# EAGLE design P15_Dual (EAGLE 9.6.2)
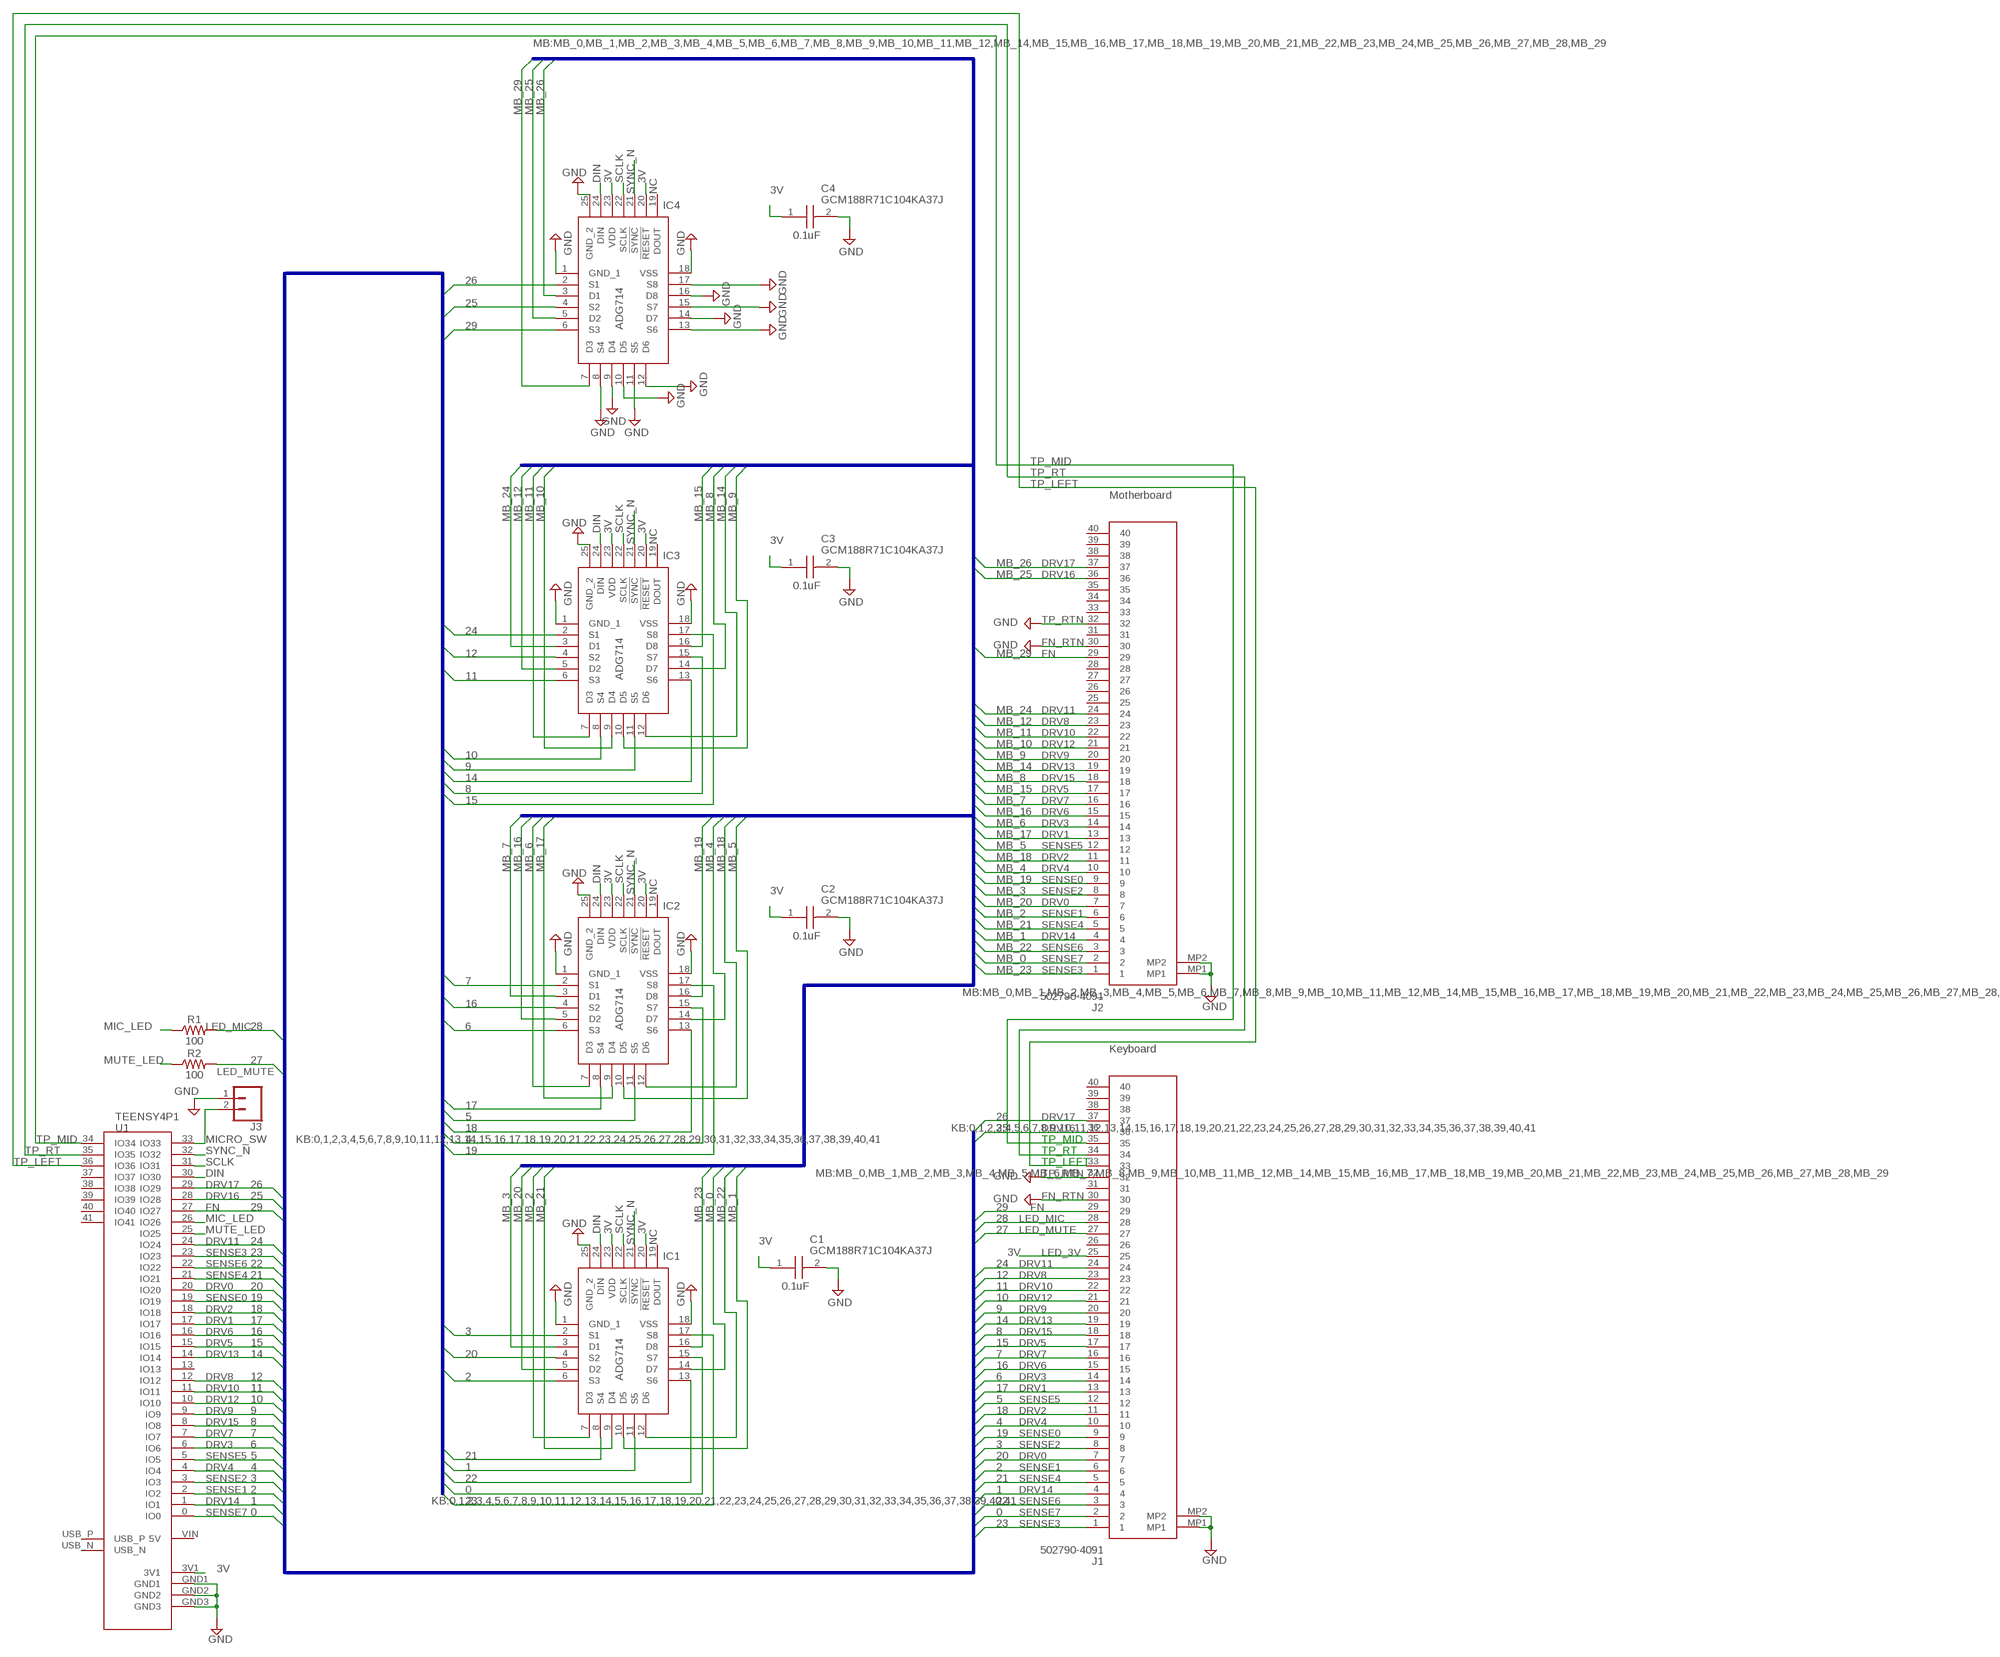
[diagram p0: schematic, sheet 1]

## Parts
C1  GCM188R71C104KA37J  [CAPC1608X90N]
C2  GCM188R71C104KA37J  [CAPC1608X90N]
C3  GCM188R71C104KA37J  [CAPC1608X90N]
C4  GCM188R71C104KA37J  [CAPC1608X90N]
IC1  ADG714BCPZ-REEL7  [QFN50P400X400X80-25N]
IC2  ADG714BCPZ-REEL7  [QFN50P400X400X80-25N]
IC3  ADG714BCPZ-REEL7  [QFN50P400X400X80-25N]
IC4  ADG714BCPZ-REEL7  [QFN50P400X400X80-25N]
J1  502790-4091  [5027904091]
J2  502790-4091  [5027904091]
J3  CONN_02  [1X02]
R1  100  0603_RESISTOR  [0603_RESISTOR]
R2  100  0603_RESISTOR  [0603_RESISTOR]
U1  TEENSY4P1  TEENSY4P1_CUTOUT_USB  [TEENSY4P1_CUTOUT_USB]

## Nets
0: IC1.15(S7) J1.2 U1.0(IO0)
1: IC1.11(S5) J1.4 U1.1(IO1)
2: IC1.6(S3) J1.6 U1.2(IO2)
3: IC1.2(S1) J1.8 U1.3(IO3)
3V: C1.1 C2.1 C3.1 C4.1 IC1.20(!RESET) IC1.23(VDD) IC2.20(!RESET) IC2.23(VDD) IC3.20(!RESET) IC3.23(VDD) IC4.20(!RESET) IC4.23(VDD) J1.25 U1.3V1
4: IC2.15(S7) J1.10 U1.4(IO4)
5: IC2.11(S5) J1.12 U1.5(IO5)
6: IC2.6(S3) J1.14 U1.6(IO6)
7: IC2.2(S1) J1.16 U1.7(IO7)
8: IC3.15(S7) J1.18 U1.8(IO8)
9: IC3.11(S5) J1.20 U1.9(IO9)
10: IC3.8(S4) J1.21 U1.10(IO10)
11: IC3.6(S3) J1.22 U1.11(IO11)
12: IC3.4(S2) J1.23 U1.12(IO12)
14: IC3.13(S6) J1.19 U1.14(IO14)
15: IC3.17(S8) J1.17 U1.15(IO15)
16: IC2.4(S2) J1.15 U1.16(IO16)
17: IC2.8(S4) J1.13 U1.17(IO17)
18: IC2.13(S6) J1.11 U1.18(IO18)
19: IC2.17(S8) J1.9 U1.19(IO19)
20: IC1.4(S2) J1.7 U1.20(IO20)
21: IC1.8(S4) J1.5 U1.21(IO21)
22: IC1.13(S6) J1.3 U1.22(IO22)
23: IC1.17(S8) J1.1 U1.23(IO23)
24: IC3.2(S1) J1.24 U1.24(IO24)
25: IC4.4(S2) J1.36 U1.28(IO28)
26: IC4.2(S1) J1.37 U1.29(IO29)
27: J1.27 R2.2
28: J1.28 R1.2
29: IC4.6(S3) J1.29 U1.27(IO27)
DIN: IC1.24(DIN) IC2.24(DIN) IC3.24(DIN) IC4.24(DIN) U1.30(IO30)
GND: C1.2 C2.2 C3.2 C4.2 IC1.1(GND_1) IC1.18(VSS) IC1.25(GND_2) IC2.1(GND_1) IC2.18(VSS) IC2.25(GND_2) IC3.1(GND_1) IC3.18(VSS) IC3.25(GND_2) IC4.1(GND_1) IC4.8(S4) IC4.9(D4) IC4.10(D5) IC4.11(S5) IC4.12(D6) IC4.13(S6) IC4.14(D7) IC4.15(S7) IC4.16(D8) IC4.17(S8) IC4.18(VSS) IC4.25(GND_2) J1.30 J1.32 J1.MP1 J1.MP2 J2.30 J2.32 J2.MP1 J2.MP2 J3.1 U1.GND1 U1.GND2 U1.GND3
MB_0: IC1.14(D7) J2.2
MB_1: IC1.10(D5) J2.4
MB_2: IC1.7(D3) J2.6
MB_3: IC1.3(D1) J2.8
MB_4: IC2.14(D7) J2.10
MB_5: IC2.10(D5) J2.12
MB_6: IC2.7(D3) J2.14
MB_7: IC2.3(D1) J2.16
MB_8: IC3.14(D7) J2.18
MB_9: IC3.10(D5) J2.20
MB_10: IC3.9(D4) J2.21
MB_11: IC3.7(D3) J2.22
MB_12: IC3.5(D2) J2.23
MB_14: IC3.12(D6) J2.19
MB_15: IC3.16(D8) J2.17
MB_16: IC2.5(D2) J2.15
MB_17: IC2.9(D4) J2.13
MB_18: IC2.12(D6) J2.11
MB_19: IC2.16(D8) J2.9
MB_20: IC1.5(D2) J2.7
MB_21: IC1.9(D4) J2.5
MB_22: IC1.12(D6) J2.3
MB_23: IC1.16(D8) J2.1
MB_24: IC3.3(D1) J2.24
MB_25: IC4.5(D2) J2.36
MB_26: IC4.3(D1) J2.37
MB_29: IC4.7(D3) J2.29
MIC_LED: R1.1 U1.26(IO26)
MICRO_SW: J3.2 U1.33(IO33)
MUTE_LED: R2.1 U1.25(IO25)
SCLK: IC1.22(SCLK) IC2.22(SCLK) IC3.22(SCLK) IC4.22(SCLK) U1.31(IO31)
SYNC_N: IC1.21(!SYNC) IC2.21(!SYNC) IC3.21(!SYNC) IC4.21(!SYNC) U1.32(IO32)
TP_LEFT: J1.33 U1.36(IO36)
TP_MID: J1.35 U1.34(IO34)
TP_RT: J1.34 U1.35(IO35)
Unconnected: IC1.19(DOUT) IC2.19(DOUT) IC3.19(DOUT) IC4.19(DOUT) J1.26 J1.31 J1.38 J1.39 J1.40 J2.25 J2.26 J2.27 J2.28 J2.31 J2.33 J2.34 J2.35 J2.38 J2.39 J2.40 U1.13(IO13) U1.37(IO37) U1.38(IO38) U1.39(IO39) U1.40(IO40) U1.41(IO41) U1.USB_N U1.USB_P U1.VIN(5V)

## Buses
KB:0,1,2,3,4,5,6,7,8,9,10,11,12,13,14,15,16,17,18,19,20,21,22,23,24,25,26,27,28,29,30,31,32,33,34,35,36,37,38,39,40,41
MB:MB_0,MB_1,MB_2,MB_3,MB_4,MB_5,MB_6,MB_7,MB_8,MB_9,MB_10,MB_11,MB_12,MB_14,MB_15,MB_16,MB_17,MB_18,MB_19,MB_20,MB_21,MB_22,MB_23,MB_24,MB_25,MB_26,MB_27,MB_28,MB_29

## Notes on the sheet
- NC
- 0.1uF
- ADG714
- Motherboard
- NC
- DRV17
- DRV16
- 0.1uF
- TP_RTN
- FN_RTN
- FN
- ADG714
- DRV11
- DRV8
- DRV10
- DRV12
- DRV9
- DRV13
- DRV15
- DRV5
- DRV7
- DRV6
- DRV3
- DRV1
- SENSE5
- DRV2
- DRV4
- SENSE0
- NC | SENSE2
- DRV0
- SENSE1
- SENSE4
- 0.1uF | DRV14
- SENSE6
- SENSE7
- SENSE3
- LED_MIC | ADG714
- Keyboard
- LED_MUTE
- DRV17
- DRV16
- TP_MID
- TP_RT
- TP_LEFT
- TP_RTN
- DRV17
- DRV16 | FN_RTN
- FN | FN
- LED_MIC
- LED_MUTE
- DRV11 | NC
- SENSE3 | LED_3V
- SENSE6 | DRV11
- SENSE4 | DRV8
- DRV0 | 0.1uF | DRV10
- SENSE0 | DRV12
- DRV2 | DRV9
- DRV1 | DRV13
- DRV6 | DRV15
- DRV5 | DRV5
- DRV13 | DRV7
- DRV6
- DRV8 | ADG714 | DRV3
- DRV10 | DRV1
- DRV12 | SENSE5
- DRV9 | DRV2
- DRV15 | DRV4
- DRV7 | SENSE0
- DRV3 | SENSE2
- SENSE5 | DRV0
- DRV4 | SENSE1
- SENSE2 | SENSE4
- SENSE1 | DRV14
- DRV14 | SENSE6
- SENSE7 | SENSE7
- SENSE3

## Library data of the parts
C1-C4 = SamacSys_Parts:GCM188R71C104KA37J: Multilayer Ceramic Capacitors MLCC - SMD/SMT .1uF 16Volts 10% Source: Datasheet <https://search.murata.co.jp/Ceramy/image/img/A01X/G101/ENG/GCM188R71C104KA37-01A.pdf>; DESCRIPTION: Multilayer Ceramic Capacitors MLCC - SMD/SMT .1uF 16Volts 10%; HEIGHT: 0.9mm; MANUFACTURER_NAME: Murata Electronics; MANUFACTURER_PART_NUMBER: GCM188R71C104KA37J; MOUSER_PART_NUMBER: 81-GCM188R71C104KA7J; MOUSER_PRICE-STOCK: https://www.mouser.co.uk/ProductDetail/Murata-Electronics/GCM188R71C104KA37J?qs=bGEzvQhTDnZD08oWyjLpYQ%3D%3D
IC1-IC4 = SamacSys_Parts:ADG714BCPZ-REEL7: Analog Switch ICs Low Voltage 3-wire Serially Controlled O Source: Datasheet <https://www.arrow.com/en/products/adg714bcpz-reel7/analog-devices>; DESCRIPTION: Analog Switch ICs Low Voltage 3-wire Serially Controlled O; HEIGHT: 0.8mm; MANUFACTURER_NAME: Analog Devices; MANUFACTURER_PART_NUMBER: ADG714BCPZ-REEL7; MOUSER_PART_NUMBER: 584-ADG714BCPZ-REEL7; MOUSER_PRICE-STOCK: https://www.mouser.co.uk/ProductDetail/Analog-Devices/ADG714BCPZ-REEL7?qs=%252BEew9%252B0nqrB1ZnOhtN6Fvw%3D%3D
J1 J2 = SamacSys_Parts:502790-4091: MOLEX - 502790-4091 - CONNECTOR, FPC, 40POS, 1ROW, 0.5MM Source: Datasheet <https://componentsearchengine.com/Datasheets/1/502790-4091.pdf>; DESCRIPTION: MOLEX - 502790-4091 - CONNECTOR, FPC, 40POS, 1ROW, 0.5MM; HEIGHT: 2.7mm; MANUFACTURER_NAME: Molex; MANUFACTURER_PART_NUMBER: 502790-4091; MOUSER_PART_NUMBER: 538-502790-4091; MOUSER_PRICE-STOCK: https://www.mouser.co.uk/ProductDetail/Molex/502790-4091?qs=3OKVfsn1b5DQ%252BzBia5ygSg%3D%3D
J3 = SparkFun-Connectors:CONN_02: Multi connection point. Often used as Generic Header-pin footprint for 0.1 inch spaced/style header connections On any of the 0.1 inch spaced packages, you can populate with these: Break Away Headers - Straight <https://www.sparkfun.com/products/116> (PRT-00116) Break Away Male Headers - Right Angle <https://www.sparkfun.com/products/553> (PRT-00553) Female Headers <https://www.sparkfun.com/products/115> (PRT-00115) Break Away Headers - Machine Pin <https://www.sparkfun.com/products/117> (PRT-00117) Break Away Female Headers - Swiss Machine Pin <https://www.sparkfun.com/products/743> (PRT-00743) For SCREWTERMINALS and SPRING TERMINALS visit here: Screw Terimnals on SparkFun.com <https://www.sparkfun.com/search/results?term=Screw+Terminals> (5mm/3.5mm/2.54mm spacing) This device is also useful as a general connection point to wire up your design to another part of your project. Our various solder wires solder well into these plated through hole pads. Hook-Up Wire - Assortment (Stranded, 22 AWG) <https://www.sparkfun.com/products/11375> (PRT-11375) Hook-Up Wire - Assortment (Solid Core, 22 AWG) <https://www.sparkfun.com/products/11367> (PRT-11367) View the entire wire category on our website here <https://www.sparkfun.com/categories/141> Special notes: Molex polarized connector foot print use with: PRT-08233 with associated crimp pins and housings. 2.54_SCREWTERM for use with PRT-10571. 3.5mm Screw Terminal footprints for PRT-08084 5mm Screw Terminal footprints for use with PRT-08432
R1 R2 = 0603_RESISTOR:0603_RESISTOR
U1 = TEENSY4P1_CUTOUT_USB:TEENSY4P1_CUTOUT_USB

## Board
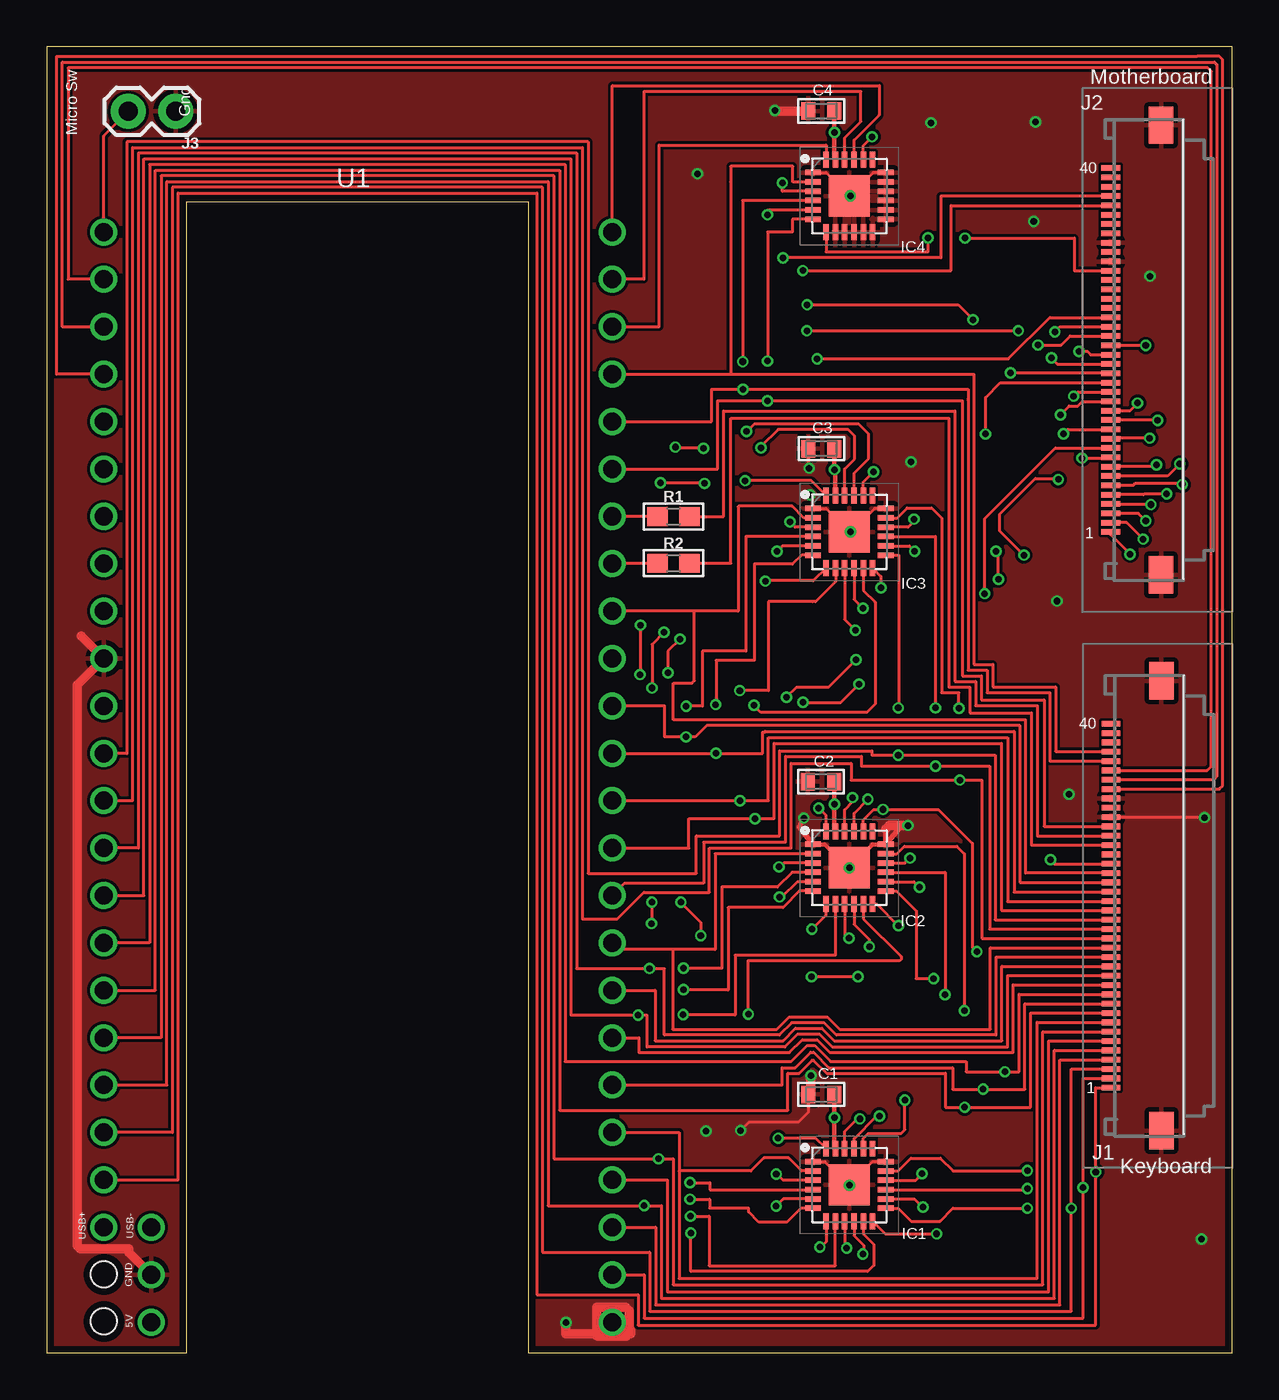
[diagram p1: board, top side]
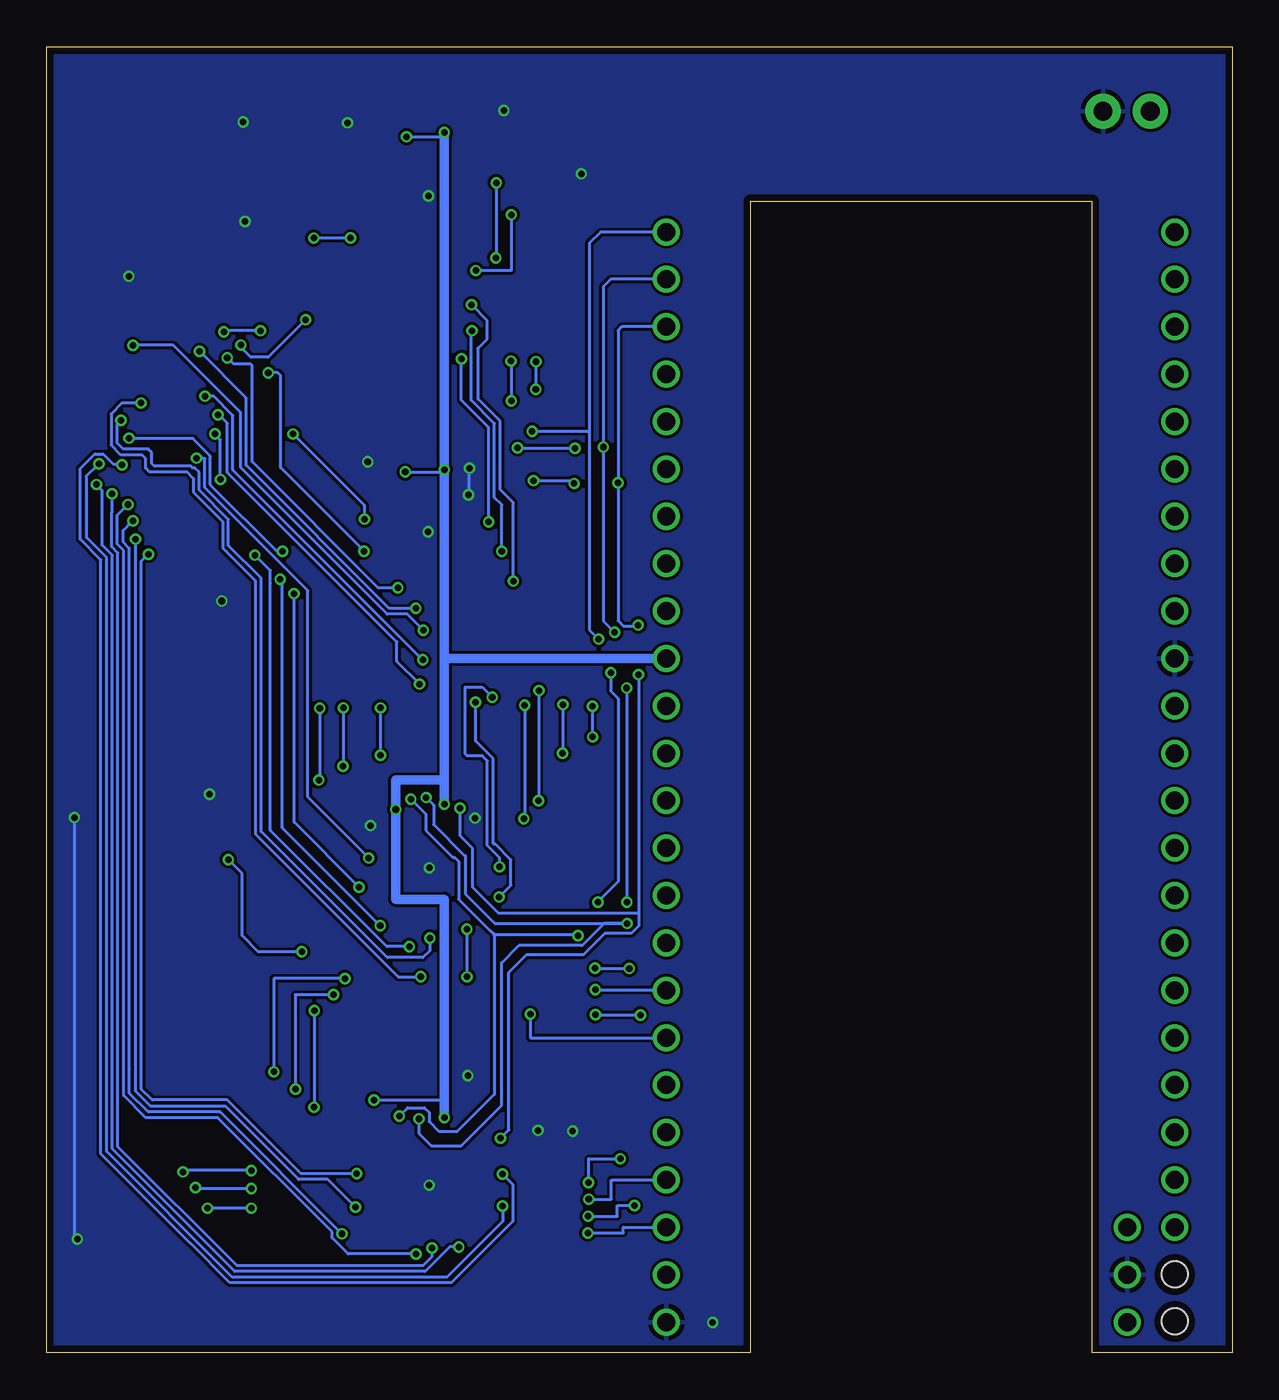
[diagram p2: board, bottom side, seen from below]

Size 63.5 x 70 mm. Coordinates in mm from the lower left corner, seen from the top.
Outline: 0,0 7.5,0 7.5,61.7 25.8,61.7 25.8,0 63.5,0 63.5,70 0,70 0,0
Copper layers (1*16): Top 0.035559375mm / dielectric 1.6mm / Bottom 0.035559375mm
Design rules "oshpark-2layer": minimum track width 6mil, minimum drill 10mil, track to track 6mil, track to pad 6mil, pad to pad 6mil, via to via 6mil, smd to smd 6mil, copper to edge 15mil, drill to drill 6mil, minimum pad ring 5mil, minimum via ring 5mil, stop-mask expansion 2.5mil, vias tented up to drill 0mil, thermal gap 10mil
Holes 1.4 mm at 3.07,1.68 3.07,4.2

### Footprints (pad centres in the part's own frame; a part is rotated, then mirrored left to right if it is on the bottom)
CAPC1608X90N = smd 0.75 x 0.94: 1 -0.7,0; 2 0.7,0
QFN50P400X400X80-25N = smd 0.85 x 0.3: 1 -1.95,1.25; 2 -1.95,0.75; 3 -1.95,0.25; 4 -1.95,-0.25; 5 -1.95,-0.75; 6 -1.95,-1.25; 13 1.95,-1.25; 14 1.95,-0.75; 15 1.95,-0.25; 16 1.95,0.25; 17 1.95,0.75; 18 1.95,1.25 | smd 0.3 x 0.85: 7 -1.25,-1.95; 8 -0.75,-1.95; 9 -0.25,-1.95; 10 0.25,-1.95; 11 0.75,-1.95; 12 1.25,-1.95; 19 1.25,1.95; 20 0.75,1.95; 21 0.25,1.95; 22 -0.25,1.95; 23 -0.75,1.95; 24 -1.25,1.95 | smd 2.2 x 2.2: 25 0,0
5027904091 = smd 0.3 x 1: 1 -9.75,2.6; 2 -9.25,2.6; 3 -8.75,2.6; 4 -8.25,2.6; 5 -7.75,2.6; 6 -7.25,2.6; 7 -6.75,2.6; 8 -6.25,2.6; 9 -5.75,2.6; 10 -5.25,2.6; 11 -4.75,2.6; 12 -4.25,2.6; 13 -3.75,2.6; 14 -3.25,2.6; 15 -2.75,2.6; 16 -2.25,2.6; 17 -1.75,2.6; 18 -1.25,2.6; 19 -0.75,2.6; 20 -0.25,2.6; 21 0.25,2.6; 22 0.75,2.6; 23 1.25,2.6; 24 1.75,2.6; 25 2.25,2.6; 26 2.75,2.6; 27 3.25,2.6; 28 3.75,2.6; 29 4.25,2.6; 30 4.75,2.6; 31 5.25,2.6; 32 5.75,2.6; 33 6.25,2.6; 34 6.75,2.6; 35 7.25,2.6; 36 7.75,2.6; 37 8.25,2.6; 38 8.75,2.6; 39 9.25,2.6; 40 9.75,2.6 | smd 2 x 1.3: MP1 -12.05,-0.1; MP2 12.05,-0.1
1X02 = drill 1.016 pad 1.88: 1 0,0; 2 2.54,0
0603_RESISTOR = smd 1.1 x 1: 1 -0.85,0; 2 0.85,0
TEENSY4P1_CUTOUT_USB = drill 0.965: 0 -15.24,-13.62; 1 -12.7,-13.62; 2 -10.16,-13.62; 3 -7.62,-13.62; 3V1 17.78,-13.62; 4 -5.08,-13.62; 5 -2.54,-13.62; 6 0,-13.62; 7 2.54,-13.62; 8 5.08,-13.62; 9 7.62,-13.62; 10 10.16,-13.62; 11 12.7,-13.62; 12 15.24,-13.62; 13 15.24,13.62; 14 12.7,13.62; 15 10.16,13.62; 16 7.62,13.62; 17 5.08,13.62; 18 2.54,13.62; 19 0,13.62; 20 -2.54,13.62; 21 -5.08,13.62; 22 -7.62,13.62; 23 -10.16,13.62; 24 20.32,-13.62; 25 22.86,-13.62; 26 25.4,-13.62; 27 27.94,-13.62; 28 30.48,-13.62; 29 33.02,-13.62; 30 35.56,-13.62; 31 38.1,-13.62; 32 40.64,-13.62; 33 40.64,13.62; 34 38.1,13.62; 35 35.56,13.62; 36 33.02,13.62; 37 30.48,13.62; 38 27.94,13.62; 39 25.4,13.62; 40 22.86,13.62; 41 20.32,13.62; GND1 -17.78,-13.62; GND2 -15.24,11.08; GND3 17.78,13.62; USB_N -12.7,11.08; USB_P -12.7,13.62; VIN -17.78,11.08

### Placement (x,y rotation side)
C1  41.49,13.85 180 top
C2  41.48,30.61 180 top
C3  41.5,48.45 180 top
C4  41.5,66.55 180 top
IC1  43,9 0 top
IC2  43,26 0 top
IC3  43,44 0 top
IC4  43,62 0 top
J1  59.62,23.96 90 top
J2  59.6,53.74 90 top
J3  6.91,66.53 180 top
R1  33.58,44.82 0 top
R2  33.58,42.32 0 top
U1  16.68,19.43 90 top

### Tracks (layer width: path | path; a pad name or v marks a point on that pad's centre or on a via)
0  (via drill 0.35)
  Top 0.152: J1.2 55.52,14.71 v55.52,8.85 55.52,1.86 32,1.86 32,4.19 U1.0 | IC1.15 52.55,8.75 v52.55,8.8 v52.53,8.8
  Bottom 0.152: v52.53,8.8 55.51,8.8 55.51,8.85 v55.52,8.85
1  (via drill 0.35)
  Top 0.152: U1.1 32.62,6.73 32.62,2.56 54.28,2.56 54.28,15.7 J1.4 | IC1.11 43.75,6.37 44.31,5.81 44.31,4.69 43.98,4.37 34.52,4.37 v34.52,6.42 v34.51,6.42
  Bottom 0.152: v34.51,6.42 32.61,6.42 32.61,6.73 U1.1
2  (via drill 0.35)
  Top 0.152: U1.2 33.25,9.27 33.25,3.26 53.68,3.26 53.68,16.71 J1.6 | IC1.6 40.41,7.75 39.66,7 38.15,7 37.6,7.55 37.6,7.75 35.51,7.75 35.51,8.23 v34.46,8.23
  Bottom 0.152: v34.46,8.23 33.25,8.23 33.25,9.27 U1.2
3
  Top 0.152: U1.3 33.88,11.81 33.88,9.75 | J1.8 53.07,17.71 53.07,3.98 33.88,3.98 33.88,9.75 | IC1.2 40.45,9.75 39.75,10.45 38.42,10.45 37.72,9.75 33.88,9.75
3V  (via drill 0.35)
  Top 0.152: IC4.20 43.75,64.7 v44.21,65.16 v44.22,65.16 v44.22,65.17 | IC3.20 43.75,46.67 v44.29,47.21 | IC2.20 43.75,28.57 44.3,29.12 v44.8,29.12 47.77,29.12 49.59,27.3 49.59,21.74 v49.83,21.5 | IC1.20 43.75,11.5 44.01,11.76 45.77,11.76 45.97,11.96 v45.97,13.55 | v53.77,26.43 53.99,26.21 J1.25
  Top 0.254: IC3.23 42.25,47.28 v42.2,47.33 C3.1 | IC4.23 42.2,64 v42.2,65.4 C4.1 | IC2.23 42.2,28 v42.2,29.4 v42.19,29.41 C2.1 | IC1.23 42.2,11 v42.2,12.6 C1.1
  Bottom 0.152: v44.22,65.17 42.26,65.17 42.2,65.11 | v44.29,47.21 42.21,47.21 42.2,47.2 | v42.2,29.4 42.2,30.69 | v49.83,21.5 52.17,21.5 53.03,22.36 53.03,25.69 v53.77,26.43 | 42.2,13.63 42.28,13.55 v45.97,13.55
  Bottom 0.508: v42.2,65.4 42.2,65.11 v42.2,47.33 42.2,47.2 42.2,37.21 | 42.2,37.21 v42.2,29.4 | v42.2,12.6 42.2,13.63 42.2,24.3 44.8,24.3 v44.8,29.12 44.8,30.69 42.2,30.69 | U1.3V1 42.2,37.21
4  (via drill 0.35)
  Top 0.152: U1.4 39.41,14.35 39.41,15.29 40.1,15.29 40.92,16.11 41.09,16.11 41.91,15.29 48.53,15.29 48.53,14.13 v50.17,14.13 52.41,14.13 52.41,18.71 J1.10 | v48.13,19.19 48.13,25.75 IC2.15
  Bottom 0.152: v48.13,19.19 50.19,19.19 50.19,14.13 v50.17,14.13
5  (via drill 0.35)
  Top 0.152: U1.5 31.73,16.89 31.73,16.09 39.79,16.09 40.48,16.78 41.27,16.78 41.96,16.09 51.78,16.09 51.78,19.72 J1.12 | IC2.11 43.75,23.26 45.77,21.24 45.77,21.08 45.7,21 37.56,21 37.56,18.15 v37.59,18.15
  Bottom 0.152: v37.59,18.15 37.59,16.89 U1.5
6  (via drill 0.35)
  Top 0.152: U1.6 32.59,19.43 32.59,16.73 39.45,16.73 40.11,17.39 41.52,17.39 42.18,16.73 51.17,16.73 51.17,20.71 J1.14 | IC2.6 40.33,24.75 39.45,23.87 36.51,23.87 36.51,19.45 v34.11,19.45 v34.11,19.46
  Bottom 0.152: v34.11,19.46 30.3,19.46 U1.6
7
  Top 0.152: U1.7 30.66,21.61 33.54,21.61 | J1.16 50.56,21.71 50.56,17.34 42.48,17.34 41.82,18 39.78,18 39.12,17.34 33.54,17.34 33.54,21.61 | IC2.2 35.81,26.75 35.81,21.61 33.54,21.61
8  (via drill 0.35)
  Top 0.152: U1.8 30.95,25.16 35.2,25.16 35.2,27.36 39.58,27.36 39.58,31.96 43.64,31.96 43.64,31.44 v47.62,31.44 50.51,31.44 50.51,22.71 J1.18 | IC3.15 47.61,43.75 v47.61,34.56
  Bottom 0.152: v47.61,34.56 v47.61,31.44 v47.62,31.44
9  (via drill 0.35)
  Top 0.152: J1.20 51.14,23.71 51.14,32.66 38.97,32.66 38.97,28.63 v37.94,28.63 34.41,28.63 34.41,27.05 U1.9 | IC3.11 43.75,40.86 44.38,40.23 44.38,34.77 43.94,34.33 38.26,34.33 v37.89,34.7
  Bottom 0.152: v37.94,28.63 37.89,28.63 v37.89,34.7
10  (via drill 0.35)
  Top 0.152: J1.21 57.02,24.19 51.48,24.19 51.48,32.97 38.66,32.97 38.66,29.59 v37.15,29.59 U1.10 | v37.13,35.49 38.66,35.49 38.66,40.26 41.04,40.26 41.19,40.26 42.27,41.34 42.27,42.03 IC3.8
  Bottom 0.152: v37.13,35.49 37.13,29.58 v37.15,29.58 v37.15,29.59
11  (via drill 0.35)
  Top 0.152: J1.22 51.83,24.7 51.83,33.31 38.49,33.31 38.49,33.27 38.36,33.27 38.36,32.13 v35.86,32.13 U1.11 | v35.84,34.74 35.87,34.74 35.87,37.11 37.91,37.11 37.91,42.28 37.93,42.26 39.95,42.26 40.44,42.75 IC3.6
  Bottom 0.152: v35.84,34.74 35.84,32.1 35.86,32.1 v35.86,32.13
12  (via drill 0.35)
  Top 0.152: U1.12 33.1,34.67 33.1,33.01 v34.25,33.01 34.74,33.01 35.35,33.62 52.14,33.62 52.14,25.21 J1.23 | v34.26,34.65 v34.26,34.66 35.13,34.66 35.13,37.61 37.46,37.61 37.46,43.75 IC3.4
  Bottom 0.152: v34.26,34.65 v34.26,33.01 v34.25,33 v34.25,33.01
14  (via drill 0.35)
  Top 0.152: U1.14 4.3,32.12 4.3,64.9 29,64.9 29,25.7 34.8,25.7 34.8,27.71 39.27,27.71 39.27,32.27 44.21,32.27 44.21,32.03 v45.62,32.03 50.81,32.03 50.81,23.21 J1.19 | IC3.13 45.65,42.75 45.65,34.56 v45.62,34.56
  Bottom 0.152: v45.62,34.56 v45.62,32.03
15  (via drill 0.35)
  Top 0.152: U1.15 4.6,29.59 4.6,64.6 28.7,64.6 28.7,23.25 30.56,23.25 31.99,24.68 35.51,24.68 35.51,27.05 39.88,27.05 39.88,31.59 43.09,31.59 43.09,30.7 v48.92,30.7 50.1,30.7 50.1,22.21 J1.17 | v48.87,34.54 48.87,35.37 47.94,35.37 47.94,44.75 47.41,45.28 46.1,45.28 45.57,44.75 IC3.17
  Bottom 0.152: v48.87,34.54 48.87,30.73 48.92,30.73 v48.92,30.7
16  (via drill 0.35)
  Top 0.152: U1.16 4.91,27.05 4.91,64.29 28.39,64.29 28.39,20.6 v32.29,20.6 33.09,20.6 33.09,17.04 39.25,17.04 39.91,17.7 41.65,17.7 42.31,17.04 50.87,17.04 50.87,21.21 J1.15 | v34.12,20.61 36.17,20.61 36.17,24.98 36.19,24.96 39.14,24.96 39.93,25.75 IC2.4
  Bottom 0.152: v34.12,20.61 32.31,20.61 32.31,20.6 v32.29,20.6
17  (via drill 0.35)
  Top 0.152: U1.17 5.21,24.51 5.21,63.99 28.09,63.99 28.09,18.1 v31.69,18.1 32.17,18.1 32.17,16.39 39.55,16.39 40.24,17.09 41.4,17.09 42.09,16.39 51.48,16.39 51.48,20.22 J1.13 | v34.1,18.12 v34.1,18.11 36.88,18.11 36.88,21.31 42.25,21.31 IC2.8
  Bottom 0.152: v34.1,18.12 31.69,18.12 v31.69,18.1
18  (via drill 0.35)
  Top 0.152: U1.18 5.52,21.98 5.52,63.68 27.78,63.68 27.78,15.62 39.88,15.62 40.74,16.48 41.15,16.48 42,15.62 49.25,15.62 49.25,15.06 v51.33,15.06 52.1,15.06 52.1,19.22 J1.11 | IC2.13 45.52,24.75 46.57,23.7 46.58,23.7 46.58,20.06 v47.52,20.06
  Bottom 0.152: v47.52,20.06 51.33,20.06 v51.33,15.06
19  (via drill 0.35)
  Top 0.152: U1.19 5.82,19.43 5.82,63.38 27.48,63.38 27.48,13 39.71,13 39.71,14.98 40.31,14.98 41.01,15.68 41.08,15.68 41.78,14.98 48.15,14.98 48.15,13.16 v49.18,13.16 52.71,13.16 52.71,18.21 J1.9 | v49.16,18.34 49.16,26.75 48.76,27.15 45.95,27.15 45.55,26.75 IC2.17
  Bottom 0.152: v49.16,18.34 49.16,13.18 49.18,13.18 v49.18,13.16
20  (via drill 0.35)
  Top 0.152: U1.20 6.13,16.89 6.13,63.07 27.17,63.07 27.17,10.4 v32.77,10.4 33.55,10.4 33.55,3.65 53.37,3.65 53.37,17.21 J1.7 | v34.47,9.12 35.53,9.12 35.53,8.74 IC1.4
  Bottom 0.152: v34.47,9.12 34.47,10.4 v32.77,10.4
21  (via drill 0.35)
  Top 0.152: U1.21 6.43,14.35 6.43,62.77 26.87,62.77 26.87,7.89 v32.01,7.89 32.93,7.89 32.93,2.92 53.98,2.92 53.98,16.21 J1.5 | IC1.8 42.25,4.67 35.49,4.67 35.49,7.32 v34.49,7.32
  Bottom 0.152: v34.49,7.32 32.93,7.32 32.93,7.9 v32.01,7.9 v32.01,7.89
22  (via drill 0.35)
  Top 0.152: U1.22 6.74,11.81 6.74,62.46 26.56,62.46 26.56,5.4 32.3,5.4 32.3,2.23 54.89,2.23 v54.89,7.75 54.89,15.21 J1.3 | IC1.13 45.62,7.75 46.31,7.06 47.86,7.06 48.55,7.75 v52.53,7.75
  Bottom 0.152: v52.53,7.75 v54.88,7.75 54.88,7.73 54.89,7.73 v54.89,7.75
23  (via drill 0.35)
  Top 0.152: U1.23 7.04,9.27 7.04,62.16 26.26,62.16 26.26,3.12 31.69,3.12 31.69,1.49 56.2,1.49 v56.2,9.7 56.2,14.21 J1.1 | IC1.17 45.62,9.75 46.3,10.43 47.88,10.43 48.56,9.75 52.55,9.75 v52.55,9.77 v52.53,9.77
  Bottom 0.152: v52.53,9.77 56.21,9.77 56.21,9.68 56.2,9.68 v56.2,9.7
24
  Top 0.152: J1.24 52.45,25.71 52.45,33.92 33.58,33.92 33.58,35.89 34.57,35.89 34.7,36.02 34.7,39.75 | 34.7,39.75 U1.24 | 34.7,39.75 37.04,39.75 37.04,45.34 37.07,45.37 39.94,45.37 40.56,44.75 IC3.2
25  (via drill 0.35)
  Top 0.152: U1.28 35.62,49.91 35.62,51.64 v37.3,51.64 49.37,51.64 49.37,51.12 49.37,51.04 49.37,36.59 50.38,36.59 50.38,35.38 53.74,35.38 53.74,31.71 J1.36 | IC4.4 37.29,61.75 v37.29,53.12
  Bottom 0.152: v37.29,53.12 v37.29,51.64 v37.3,51.64
26
  Top 0.152: U1.29 36.64,52.45 | 36.64,52.45 49.67,52.45 49.67,36.89 50.68,36.89 50.68,35.69 54.05,35.69 54.05,32.23 57.02,32.23 J1.37 | IC4.2 39.97,62.75 39.97,63.59 36.64,63.59 36.64,62.75 36.64,52.45
27
  Top 0.152: R2.2 36.65,42.32 36.65,50.09 48.33,50.09 48.33,35.67 49.46,35.67 49.46,34.3 52.75,34.3 52.75,27.21 J1.27
28
  Top 0.152: R1.2 36.27,44.82 36.27,50.47 48.66,50.47 48.66,35.98 49.77,35.98 49.77,34.69 53.08,34.69 53.08,27.7 J1.28
29  (via drill 0.35)
  Top 0.152: U1.27 35.94,47.37 35.94,51.02 v38.61,51.02 49.06,51.02 49.06,36.28 50.07,36.28 50.07,35 53.44,35 53.44,28.21 J1.29 | IC4.6 39.95,60.75 39.95,60.07 38.62,60.07 v38.62,53.15
  Bottom 0.152: v38.62,53.15 v38.62,51.02 v38.61,51.02
DIN  (via drill 0.35)
  Top 0.152: IC4.24 41.75,64.73 32.81,64.73 32.81,54.99 U1.30 | IC3.24 40.96,46.74 v37.42,46.74 | v35.24,46.59 35.22,46.61 v32.9,46.61 v32.89,46.62 | v31.81,39 31.81,36.35 v31.79,36.35 | IC1.24 41.21,11.49 v39.2,11.49 v39.19,11.5 | v41.36,29.19 41.75,28.8 IC2.24
  Bottom 0.152: U1.30 32.68,54.99 32.89,54.78 v32.89,46.62 32.89,39.24 32.61,38.96 31.82,38.96 31.81,38.97 v31.81,39 | v37.42,46.74 35.39,46.74 v35.24,46.59 | v31.79,36.35 31.79,23.58 | 31.79,23.58 39.31,23.58 40.69,24.96 40.69,27.05 41.36,27.72 v41.36,29.19 | v39.19,11.5 38.74,11.95 38.74,20.39 37.8,21.33 34.75,21.33 33.6,22.48 32.18,22.48 31.79,22.87 31.79,23.58
GND  (via drill 0.35)
  Top 0.152: C1.2 40.79,12.88 40.27,12.36 37.62,12.36 v37.18,11.92 | IC1.1 41.69,10.25 42.94,9 IC1.25 44.24,10.25 IC1.18 | 42.93,26 IC2.25 | 45.82,28.26 v46.15,28.26 | IC3.18 44.35,45.25 43.1,44 IC3.25 41.75,45.25 IC3.1 41.05,45.97 41.04,45.98 v40.9,45.98 | IC4.1 41.75,63.25 IC4.25 43.02,62 44.27,63.25 IC4.18 | C3.2 40.8,47.46 v40.85,47.41 | J1.30 61.94,28.71 61.99,28.66 v62.02,28.69
  Top 0.203: IC2.1 41.68,27.25 42.93,26 | IC2.25 44.25,27.25 IC2.18
  Top 0.305: 44.95,28.08 IC2.18 45.82,28.26 | IC2.1 40.32,28.19 v40.56,28.66
  Top 0.508: C4.2 39.04,66.55 v39.01,66.58 | C1.2 40.94,14 v40.94,14.86 | v40.94,14.86 | 44.95,28.08 45.13,28.26 v46.15,28.26 | U1.GND2 4.41,5.38 4.41,5.58 1.8,5.58 1.64,5.74 1.64,35.79 U1.GND3 1.86,38.41 | U1.GND1 31.04,0.91 31.04,0.88 29.51,0.88 29.47,0.92 29.47,2.44 31.02,2.44 31.21,2.25 31.21,1.29 31.29,1.21 31.29,1.02 27.82,1.02 v27.82,1.63
  Bottom 0.152: v40.85,47.41 40.9,47.36 v40.9,45.98 | v62.02,28.69 62.02,6.26 v61.86,6.1
  other vias: 35.32,11.89 43.01,8.98 43,25.99 43.06,44 43.05,62 34.86,63.19 47.38,65.92 52.97,65.96 46.3,47.75 54.12,40.29 54.77,29.94 52.88,60.64 59.1,57.7
  pour Top: 0,0 0,70 63.5,70 63.5,0 25.8,0 25.8,61.7 7.5,61.7 7.5,0
  pour Bottom: 0,0 0,70 63.48,70 63.48,0 25.8,0 25.8,61.7 7.5,61.7 7.5,0
MB_0  (via drill 0.35)
  Top 0.152: IC1.14 46.49,8.25 v46.94,7.8 v46.95,7.81 | v58.74,43.61 57.86,44.49 J2.2
  Bottom 0.152: v46.95,7.81 48.44,9.29 50,9.29 53.91,13.21 57.93,13.21 58.74,14.02 v58.74,43.61
MB_1  (via drill 0.35)
  Top 0.152: IC1.10 43.25,6.28 43.76,5.77 43.76,5.34 v43.72,5.3 | v59.15,45.46 57.03,45.46 J2.4
  Bottom 0.152: v43.72,5.3 47.35,5.3 48.21,6.16 48.21,6.48 54.33,12.6 58.18,12.6 59.38,13.79 59.38,42.99 59.72,43.33 59.72,44.9 v59.15,45.46
MB_2  (via drill 0.35)
  Top 0.152: IC1.7 41.75,5.94 41.45,5.64 v41.42,5.67 | v60.84,46.53 60.8,46.58 58.3,46.58 58.21,46.49 J2.6
  Bottom 0.152: v41.42,5.67 41.92,5.67 43.22,4.37 53.43,4.37 59.98,10.92 59.98,42.74 60.53,43.29 60.53,46.22 v60.84,46.53
MB_3  (via drill 0.35)
  Top 0.152: IC1.3 39.45,9.25 v39.1,9.6 v39.09,9.59 | v59.46,47.59 59.36,47.49 J2.8
  Bottom 0.152: v39.09,9.59 38.53,9.03 38.53,7.04 41.81,3.76 53.68,3.76 55.78,5.86 55.8,5.86 60.59,10.65 60.59,42.49 61.7,43.6 61.7,47.39 60.92,48.17 60.48,48.17 59.93,47.62 59.49,47.62 v59.46,47.59
MB_4  (via drill 0.35)
  Top 0.152: IC2.14 46.46,25.25 v46.76,24.95 v46.77,24.95 | v50.25,40.69 50.25,44.7 54.04,48.49 J2.10
  Bottom 0.152: v46.77,24.95 50.25,28.44 v50.25,40.69
MB_5  (via drill 0.35)
  Top 0.152: IC2.10 43.25,22.97 44.07,22.15 v44.07,21.77 | v52.35,42.75 51.05,44.05 51.05,44.95 52.96,46.86 54.2,46.86 v54.2,46.81 v54.2,46.8 | v54.48,49.25 54.72,49.49 J2.12
  Bottom 0.152: v44.07,21.77 45.28,21.77 51.51,28 51.51,41.23 51.52,41.24 51.52,41.93 v52.34,42.75 v52.35,42.75 | v54.2,46.8 54.2,48.92 54.49,49.22 v54.49,49.24 v54.48,49.25
MB_6  (via drill 0.35)
  Top 0.152: J2.14 58.04,50.49 v58.44,50.89 v58.44,50.9 | v43.46,20.16 v40.99,20.16 v40.98,20.15 | v40.99,22.7 41.75,23.46 IC2.7
  Bottom 0.152: v58.44,50.9 59.47,50.9 60.05,50.32 60.05,48.65 59.52,48.12 58.39,48.12 58.2,47.93 58.2,47.41 58,47.2 55.98,47.2 55.64,46.87 55.64,46.12 54.06,44.54 54.06,43.12 53.89,42.95 53.88,42.95 52.31,41.38 52.31,27.81 44.66,20.16 v43.46,20.16 | v40.98,20.15 40.98,22.68 v40.99,22.69 v40.99,22.7
MB_7  (via drill 0.35)
  Top 0.152: IC2.3 39.49,26.25 39.26,26.02 v39.23,26.05 | v43.35,37.14 41.89,35.68 40.17,35.68 v39.63,35.14 | v55.02,51.27 55.24,51.49 J2.16
  Bottom 0.152: v39.23,26.05 39.23,26.52 39.89,27.18 39.89,31.72 40.16,31.99 40.97,31.99 41.08,32.1 41.08,35.68 40.17,35.68 v39.63,35.14 | v43.35,37.14 53.52,47.31 53.52,50.23 54.56,51.27 v55.02,51.27
MB_8  (via drill 0.35)
  Top 0.152: IC3.14 46.21,43.25 v46.5,42.96 | v51.63,52.52 56.97,52.52 J2.18
  Bottom 0.152: v46.5,42.96 50.97,47.43 50.97,52.38 51.11,52.52 v51.63,52.52
MB_9  (via drill 0.35)
  Top 0.152: IC3.10 43.25,40.38 v43.73,39.9 | v55.31,53.67 55.75,53.67 55.93,53.49 J2.20
  Bottom 0.152: v43.73,39.9 45.13,39.9 52.81,47.57 52.81,51.17 v55.31,53.67
MB_10  (via drill 0.35)
  Top 0.152: IC3.9 42.75,39.3 v43.32,38.73 | v58.88,53.99 J2.21
  Bottom 0.152: v43.32,38.73 44.18,39.59 45.26,39.59 53.12,47.44 53.12,50.4 56.73,54.01 58.88,54.01 v58.88,53.99
MB_11  (via drill 0.35)
  Top 0.152: IC3.7 41.08,41.38 38.52,41.38 v38.5,41.36 | v40.74,56.17 48.83,56.17 v49.63,55.37 v49.62,55.37 | v53.1,54.01 54.34,54.01 54.83,54.5 J2.22
  Bottom 0.152: v38.5,41.36 38.5,45.56 39.21,46.27 39.21,49.93 40.38,51.1 40.38,53.85 39.9,54.33 39.9,55.33 v40.74,56.17 | v49.62,55.37 51.63,53.36 52.56,53.36 53.1,53.9 v53.1,54.01
MB_12  (via drill 0.35)
  Top 0.152: IC3.5 39.41,43.25 v39.12,42.96 | v40.72,54.78 v52.05,54.78 | v54.01,54.72 54.28,54.99 J2.23
  Bottom 0.152: v39.12,42.96 39.12,45.45 39.52,45.84 39.52,49.8 40.76,51.05 40.76,53.04 40.75,53.05 40.75,54.75 v40.72,54.78 | v52.05,54.78 53.95,54.78 v54.01,54.72
MB_14  (via drill 0.35)
  Top 0.152: IC3.12 44.69,41.61 v44.69,41 | v53.83,53.31 54.15,52.99 J2.19
  Bottom 0.152: v44.69,41 45.74,41 52.5,47.76 52.5,52.92 52.57,52.99 53.49,52.99 v53.82,53.32 v53.83,53.31
MB_15  (via drill 0.35)
  Top 0.152: v46.47,44.68 46.47,44.57 46.15,44.25 IC3.16 | v50.3,49.24 50.3,51.2 51.09,51.99 J2.17
  Bottom 0.152: v46.47,44.68 46.47,45.41 v50.3,49.24
MB_16  (via drill 0.35)
  Top 0.152: IC2.5 40.21,25.25 39.39,24.43 v39.26,24.43 | v40.52,34.86 42.54,34.86 v43.52,35.84 | J2.15 55.49,50.99 55.24,50.74 54.78,50.74 v54.31,50.27
  Bottom 0.152: v39.26,24.43 38.63,25.06 38.63,26.42 39.48,27.27 39.54,27.27 39.59,27.32 39.59,31.85 40.52,32.78 v40.52,34.86 | v43.52,35.84 44.74,37.06 44.74,38.1 53.83,47.18 53.83,49.81 54.3,50.29 v54.31,50.27
MB_17  (via drill 0.35)
  Top 0.152: IC2.9 42.76,22.41 42.96,22.21 v42.98,22.23 | v59.52,49.98 J2.13
  Bottom 0.152: v42.98,22.23 42.99,22.21 42.99,21.53 43.34,21.18 45.25,21.18 52.01,27.94 52.01,41.52 53.74,43.25 53.76,43.25 53.76,44.67 55.34,46.24 55.34,47.2 55.55,47.42 55.69,47.42 55.78,47.51 57.73,47.51 57.88,47.66 57.88,48.26 58.05,48.44 59.41,48.44 59.73,48.76 59.73,49.77 v59.52,49.98
MB_18  (via drill 0.35)
  Top 0.152: IC2.12 44.46,24.05 v45.62,22.89 v45.63,22.89 | v50.99,41.46 50.99,42.82 v50.86,42.95 | v59.09,49.02 57.03,49.02 J2.11
  Bottom 0.152: v45.63,22.89 50.87,28.13 50.87,41.34 v50.99,41.46 | v50.86,42.95 51.16,42.95 54.73,46.52 54.73,48.05 55.6,48.92 55.6,48.94 55.66,49 59.09,49 v59.09,49.02
MB_19  (via drill 0.35)
  Top 0.152: IC2.16 45.98,26.25 v46.25,26.52 | v55.47,47.95 56.96,47.95 J2.9
  Bottom 0.152: v46.25,26.52 49.51,29.78 49.51,40.85 55.03,46.37 55.03,47.92 55.47,47.92 v55.47,47.95
MB_20  (via drill 0.35)
  Top 0.152: IC1.5 39.46,8.25 v39.08,7.87 | v60.7,47.64 60.05,46.99 J2.7
  Bottom 0.152: v39.08,7.87 39.08,7.04 42.06,4.06 53.55,4.06 60.29,10.8 60.29,42.62 61.37,43.69 61.37,46.93 61.4,46.96 60.72,47.64 v60.7,47.64
MB_21  (via drill 0.35)
  Top 0.152: IC1.9 42.75,5.77 42.88,5.64 v42.86,5.62 | v60,46.03 58.8,46.03 58.76,45.99 J2.5
  Bottom 0.152: v42.86,5.62 42.86,5.16 43.35,4.67 53.3,4.67 59.68,11.05 59.68,42.87 60.02,43.21 60.02,45.02 60,45.04 v60,46.03
MB_22  (via drill 0.35)
  Top 0.152: IC1.12 44.92,6.38 v47.68,6.38 | v58.88,44.59 58.48,44.99 J2.3
  Bottom 0.152: v47.68,6.38 54.2,12.9 58.06,12.9 59.06,13.91 59.06,15.21 59.06,43.12 59.41,43.46 59.41,44.08 58.91,44.58 v58.89,44.58 v58.88,44.59
MB_23  (via drill 0.35)
  Top 0.152: IC1.16 46.56,9.25 v46.9,9.59 v46.89,9.6 | v58.04,42.8 57,43.84 J2.1
  Bottom 0.152: v46.89,9.6 49.87,9.6 53.82,13.55 57.84,13.55 58.42,14.13 58.42,42.44 58.06,42.8 v58.04,42.8
MB_24  (via drill 0.35)
  Top 0.152: IC3.3 40.1,44.25 v39.82,44.53 | v41.28,53.27 51.52,53.27 53.74,55.49 J2.24
  Bottom 0.152: v39.82,44.53 39.82,49.59 41.28,51.05 v41.28,53.27
MB_25  (via drill 0.35)
  Top 0.152: IC4.5 38.61,61.25 v38.61,60.99 | v40.51,58 48.45,58 48.45,61.49 J2.36
  Bottom 0.152: v38.61,60.99 38.61,58 v40.51,58
MB_26  (via drill 0.35)
  Top 0.152: v39.41,62.7 39.41,62.25 IC4.3 | v39.44,58.68 47.9,58.68 47.9,61.99 J2.37
  Bottom 0.152: v39.41,62.7 39.41,58.66 39.44,58.66 v39.44,58.68
MB_29  (via drill 0.35)
  Top 0.152: IC4.7 41.75,59.01 47.22,59.01 v47.22,59.75 | v49.19,59.74 55.05,59.74 55.05,57.99 J2.29
  Bottom 0.152: v47.22,59.75 v49.19,59.75 v49.19,59.74
MIC_LED
  Top 0.152: R1.1 U1.26
MICRO_SW
  Top 0.152: U1.33 3.06,65.22 J3.2
MUTE_LED
  Top 0.152: R2.1 32.7,42.29 U1.25
SCLK  (via drill 0.35)
  Top 0.152: IC4.22 42.75,65.11 43.62,65.98 43.62,67.59 31.99,67.59 31.99,57.53 U1.31 | IC3.22 42.75,47.37 43.29,47.91 43.29,49.13 42.94,49.48 39.18,49.48 38.29,48.59 38.29,48.5 v38.27,48.5 | v35.19,48.48 33.68,48.48 33.65,48.51 v33.68,48.54 | v33.07,38.61 32.43,37.97 v32.43,35.63 | IC2.22 42.75,29.1 43.19,29.54 43.19,29.76 v43.17,29.76 | v32.42,24.15 32.42,23.01 v32.41,23 v32.4,23.01 | IC1.22 42.75,11.87 43.42,12.54 v43.56,12.54
  Bottom 0.152: U1.31 33.29,57.53 33.68,57.14 v33.68,48.54 33.68,39.22 v33.07,38.61 | v38.27,48.5 35.21,48.5 v35.19,48.48 | v43.17,29.76 42.77,29.36 42.77,28.31 41.1,26.64 41.07,26.64 41.07,24.59 39.49,23.01 v32.4,23.01 33.64,23.01 34.82,21.83 38.2,21.83 39.13,20.9 39.13,13.26 41.29,11.1 42.89,11.1 43.56,11.77 v43.56,12.54 | v32.43,35.63 32.43,24.22 32.42,24.21 v32.42,24.15
SYNC_N  (via drill 0.35)
  Top 0.152: U1.32 30.3,67.91 44.61,67.91 44.61,66.33 44.59,66.33 43.25,64.99 IC4.21 | v37.49,49.39 v37.5,49.38 37.51,49.38 37.91,49.78 43.5,49.78 44.04,49.24 44.04,47.93 43.25,47.14 IC3.21 | v33.93,38.25 33.28,37.6 v33.28,36.45 | IC2.21 43.25,28.91 43.99,29.65 v43.99,29.67 | v33.97,24.15 35.04,23.08 v35.04,22.36 | IC1.21 43.25,11.48 44.46,12.69 v44.61,12.69
  Bottom 0.152: U1.32 33.83,60.07 34.42,59.48 34.42,49.32 | v37.49,49.39 34.49,49.39 34.42,49.32 | v33.93,38.25 34.42,38.74 34.42,49.32 | v33.28,36.45 33.28,35.46 32.88,35.06 32.88,25.26 33.97,24.17 v33.97,24.15 | v43.99,29.67 43.19,28.87 43.19,28 41.74,26.55 41.65,26.55 41.43,26.33 41.43,24.3 39.75,22.62 39.73,22.62 39.55,22.44 39.55,22.42 | 39.55,22.42 35.1,22.42 v35.04,22.36 | 39.55,22.42 39.52,22.39 39.52,13.85 41.52,11.85 42.46,11.85 43.01,12.4 43.01,12.88 43.27,13.14 44.16,13.14 v44.61,12.69
TP_LEFT
  Top 0.152: U1.36 0.54,52.45 0.54,69.47 61.62,69.47 61.63,69.48 62.83,69.48 63,69.31 63,30.39 62.82,30.21 J1.33
TP_MID
  Top 0.152: U1.34 1.15,57.53 1.15,68.86 62.21,68.86 62.39,68.68 62.39,31.43 62.17,31.21 J1.35
TP_RT
  Top 0.152: U1.35 0.84,54.99 0.84,69.17 62.57,69.17 62.7,69.04 62.7,30.89 62.51,30.71 J1.34

### Text on the board
tPlace: Motherboard | Gnd | Micro Sw | 40 | U1 | 1 | 40 | 1 | Keyboard | USB+ | USB- | GND | 5V